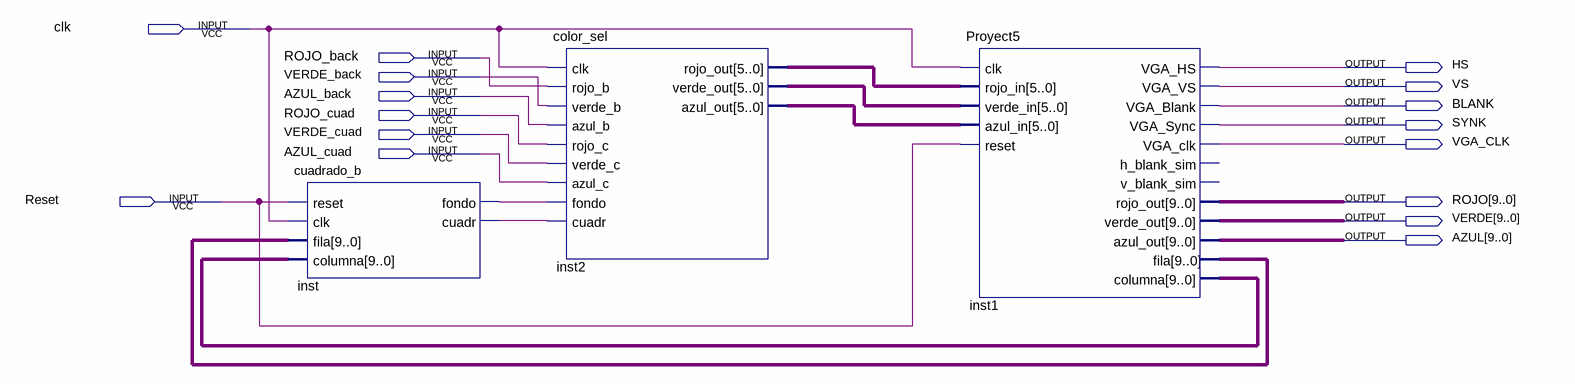
[diagram p0: schematic sheet]
// Quartus schematic b.bdf as structural Verilog: 3 symbols, 16 pins
module b (
  input  clk,
  input  ROJO_back,
  input  VERDE_back,
  input  AZUL_back,
  input  ROJO_cuad,
  input  VERDE_cuad,
  input  AZUL_cuad,
  input  Reset,
  output HS,
  output VS,
  output BLANK,
  output SYNK,
  output VGA_CLK,
  output [9:0] ROJO,
  output [9:0] VERDE,
  output [9:0] AZUL
);

  wire inst_cuadr, inst_fondo;
  wire [5:0] inst2_azul_out, inst2_rojo_out, inst2_verde_out;
  wire [9:0] inst1_columna, inst1_fila;

  cuadrado_b inst (
    .reset(Reset), .clk(clk), .fila(inst1_fila), .columna(inst1_columna), .fondo(inst_fondo),
    .cuadr(inst_cuadr));
  color_sel inst2 (
    .clk(clk), .rojo_b(ROJO_back), .verde_b(VERDE_back), .azul_b(AZUL_back), .rojo_c(ROJO_cuad),
    .verde_c(VERDE_cuad), .azul_c(AZUL_cuad), .fondo(inst_fondo), .cuadr(inst_cuadr),
    .rojo_out(inst2_rojo_out), .verde_out(inst2_verde_out), .azul_out(inst2_azul_out));
  Proyect5 inst1 (
    .clk(clk), .rojo_in(inst2_rojo_out), .verde_in(inst2_verde_out), .azul_in(inst2_azul_out), .reset(Reset),
    .VGA_HS(HS), .VGA_VS(VS), .VGA_Blank(BLANK), .VGA_Sync(SYNK), .VGA_clk(VGA_CLK), .rojo_out(ROJO),
    .verde_out(VERDE), .azul_out(AZUL), .fila(inst1_fila), .columna(inst1_columna));  // open: h_blank_sim, v_blank_sim
endmodule
